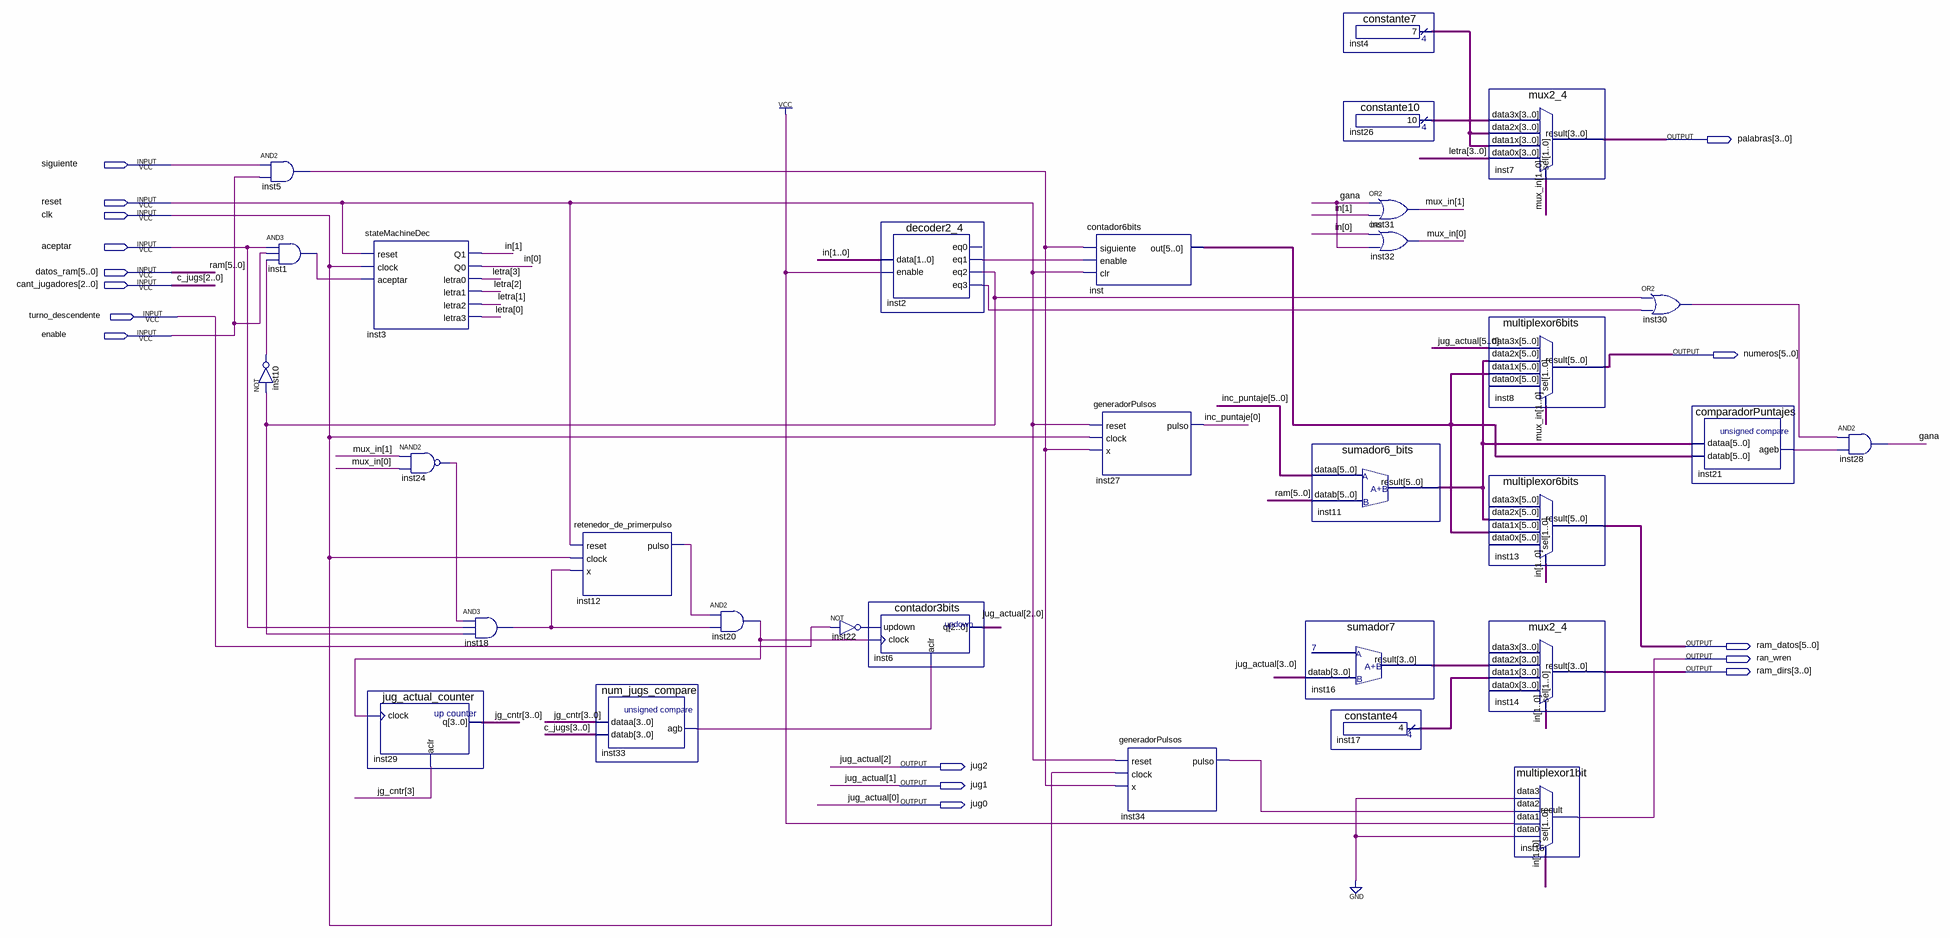
[diagram p0: schematic sheet]
// Quartus schematic decoderJuego.bdf as structural Verilog: 31 symbols, 16 pins
module decoderJuego (
  input  siguiente,
  input  reset,
  input  clk,
  input  aceptar,
  input  [5:0] datos_ram,
  input  [2:0] cant_jugadores,
  input  turno_descendente,
  input  enable,
  output [3:0] palabras,
  output [5:0] numeros,
  output [5:0] ram_datos,
  output ran_wren,
  output [3:0] ram_dirs,
  output jug2,
  output jug1,
  output jug0
);

  wire gana, inst1_out, inst2_eq1, inst2_eq2, inst2_eq3, inst5_out, inst10_out, inst12_pulso, inst18_out,
       inst20_out, inst21_ageb, inst22_out, inst24_out, inst30_out, inst33_agb, inst34_pulso;
  wire [1:0] in, mux_in;
  wire [3:0] inst4_result, inst16_result, inst17_result, inst26_result, jg_cntr, letra;
  wire [3:3] c_jugs;
  wire [5:0] inc_puntaje, inst11_result, inst_out;
  wire [5:3] jug_actual;

  and inst5 (inst5_out, siguiente, enable);
  and inst1 (inst1_out, aceptar, enable, inst10_out);
  not inst10 (inst10_out, inst2_eq2);
  stateMachineDec inst3 (
    .reset(reset), .clock(clk), .aceptar(inst1_out), .Q1(in[1]), .Q0(in[0]), .letra0(letra[3]),
    .letra1(letra[2]), .letra2(letra[1]), .letra3(letra[0]));
  jug_actual_counter inst29 (.clock(inst20_out), .aclr(jg_cntr[3]), .q(jg_cntr));
  nand inst24 (inst24_out, mux_in[1], mux_in[0]);
  and inst18 (inst18_out, inst24_out, aceptar, inst2_eq2);
  retenedor_de_primerpulso inst12 (.reset(reset), .clock(clk), .x(inst18_out), .pulso(inst12_pulso));
  num_jugs_compare inst33 (.dataa(jg_cntr), .datab({c_jugs[3], cant_jugadores}), .agb(inst33_agb));
  and inst20 (inst20_out, inst12_pulso, inst18_out);
  not inst22 (inst22_out, turno_descendente);
  decoder2_4 inst2 (.data(in), .enable(1'b1), .eq1(inst2_eq1), .eq2(inst2_eq2), .eq3(inst2_eq3));  // open: eq0
  contador3bits inst6 (.updown(inst22_out), .clock(inst20_out), .aclr(inst33_agb), .q({jug2, jug1, jug0}));
  contador6bits inst (.siguiente(inst5_out), .enable(inst2_eq1), .clr(reset), .out(inst_out));
  generadorPulsos inst27 (.reset(reset), .clock(clk), .x(inst5_out), .pulso(inc_puntaje[0]));
  generadorPulsos inst34 (.reset(reset), .clock(clk), .x(inst5_out), .pulso(inst34_pulso));
  sumador7 inst16 (.datab({jug_actual[3], jug2, jug1, jug0}), .result(inst16_result));
  constante7 inst4 (.result(inst4_result));
  constante10 inst26 (.result(inst26_result));
  sumador6_bits inst11 (.dataa(inc_puntaje), .datab(datos_ram), .result(inst11_result));
  constante4 inst17 (.result(inst17_result));
  or inst31 (mux_in[1], gana, in[1]);
  or inst32 (mux_in[0], in[0], gana);
  mux2_4 inst7 (
    .data3x(inst26_result), .data2x(inst4_result), .data1x(inst4_result), .data0x(letra), .sel(mux_in),
    .result(palabras));
  multiplexor6bits inst8 (
    .data3x({jug_actual, jug2, jug1, jug0}), .data2x(inst11_result), .data1x(inst_out), .sel(mux_in),
    .result(numeros));  // open: data0x
  multiplexor6bits inst13 (
    .data2x(inst11_result), .data1x(inst_out), .sel(in), .result(ram_datos));  // open: data3x, data0x
  mux2_4 inst14 (.data2x(inst16_result), .data1x(inst17_result), .sel(in), .result(ram_dirs));  // open: data3x, data0x
  multiplexor1bit inst15 (.data3(1'b0), .data2(inst34_pulso), .data1(1'b1), .data0(1'b0), .sel(in), .result(ran_wren));
  or inst30 (inst30_out, inst2_eq2, inst2_eq3);
  comparadorPuntajes inst21 (.dataa(inst11_result), .datab(inst_out), .ageb(inst21_ageb));
  and inst28 (gana, inst30_out, inst21_ageb);

  // Other names for the same wires on the sheet: c_jugs[2:0] = cant_jugadores; jug_actual[2:0] = {jug2, jug1, jug0};
  //   ram[5:0] = datos_ram
endmodule
